# EasyEDA Pro project 纯贴片元件搭建NE555.epro

# Schematic 纯贴片元件搭建NE555 copy
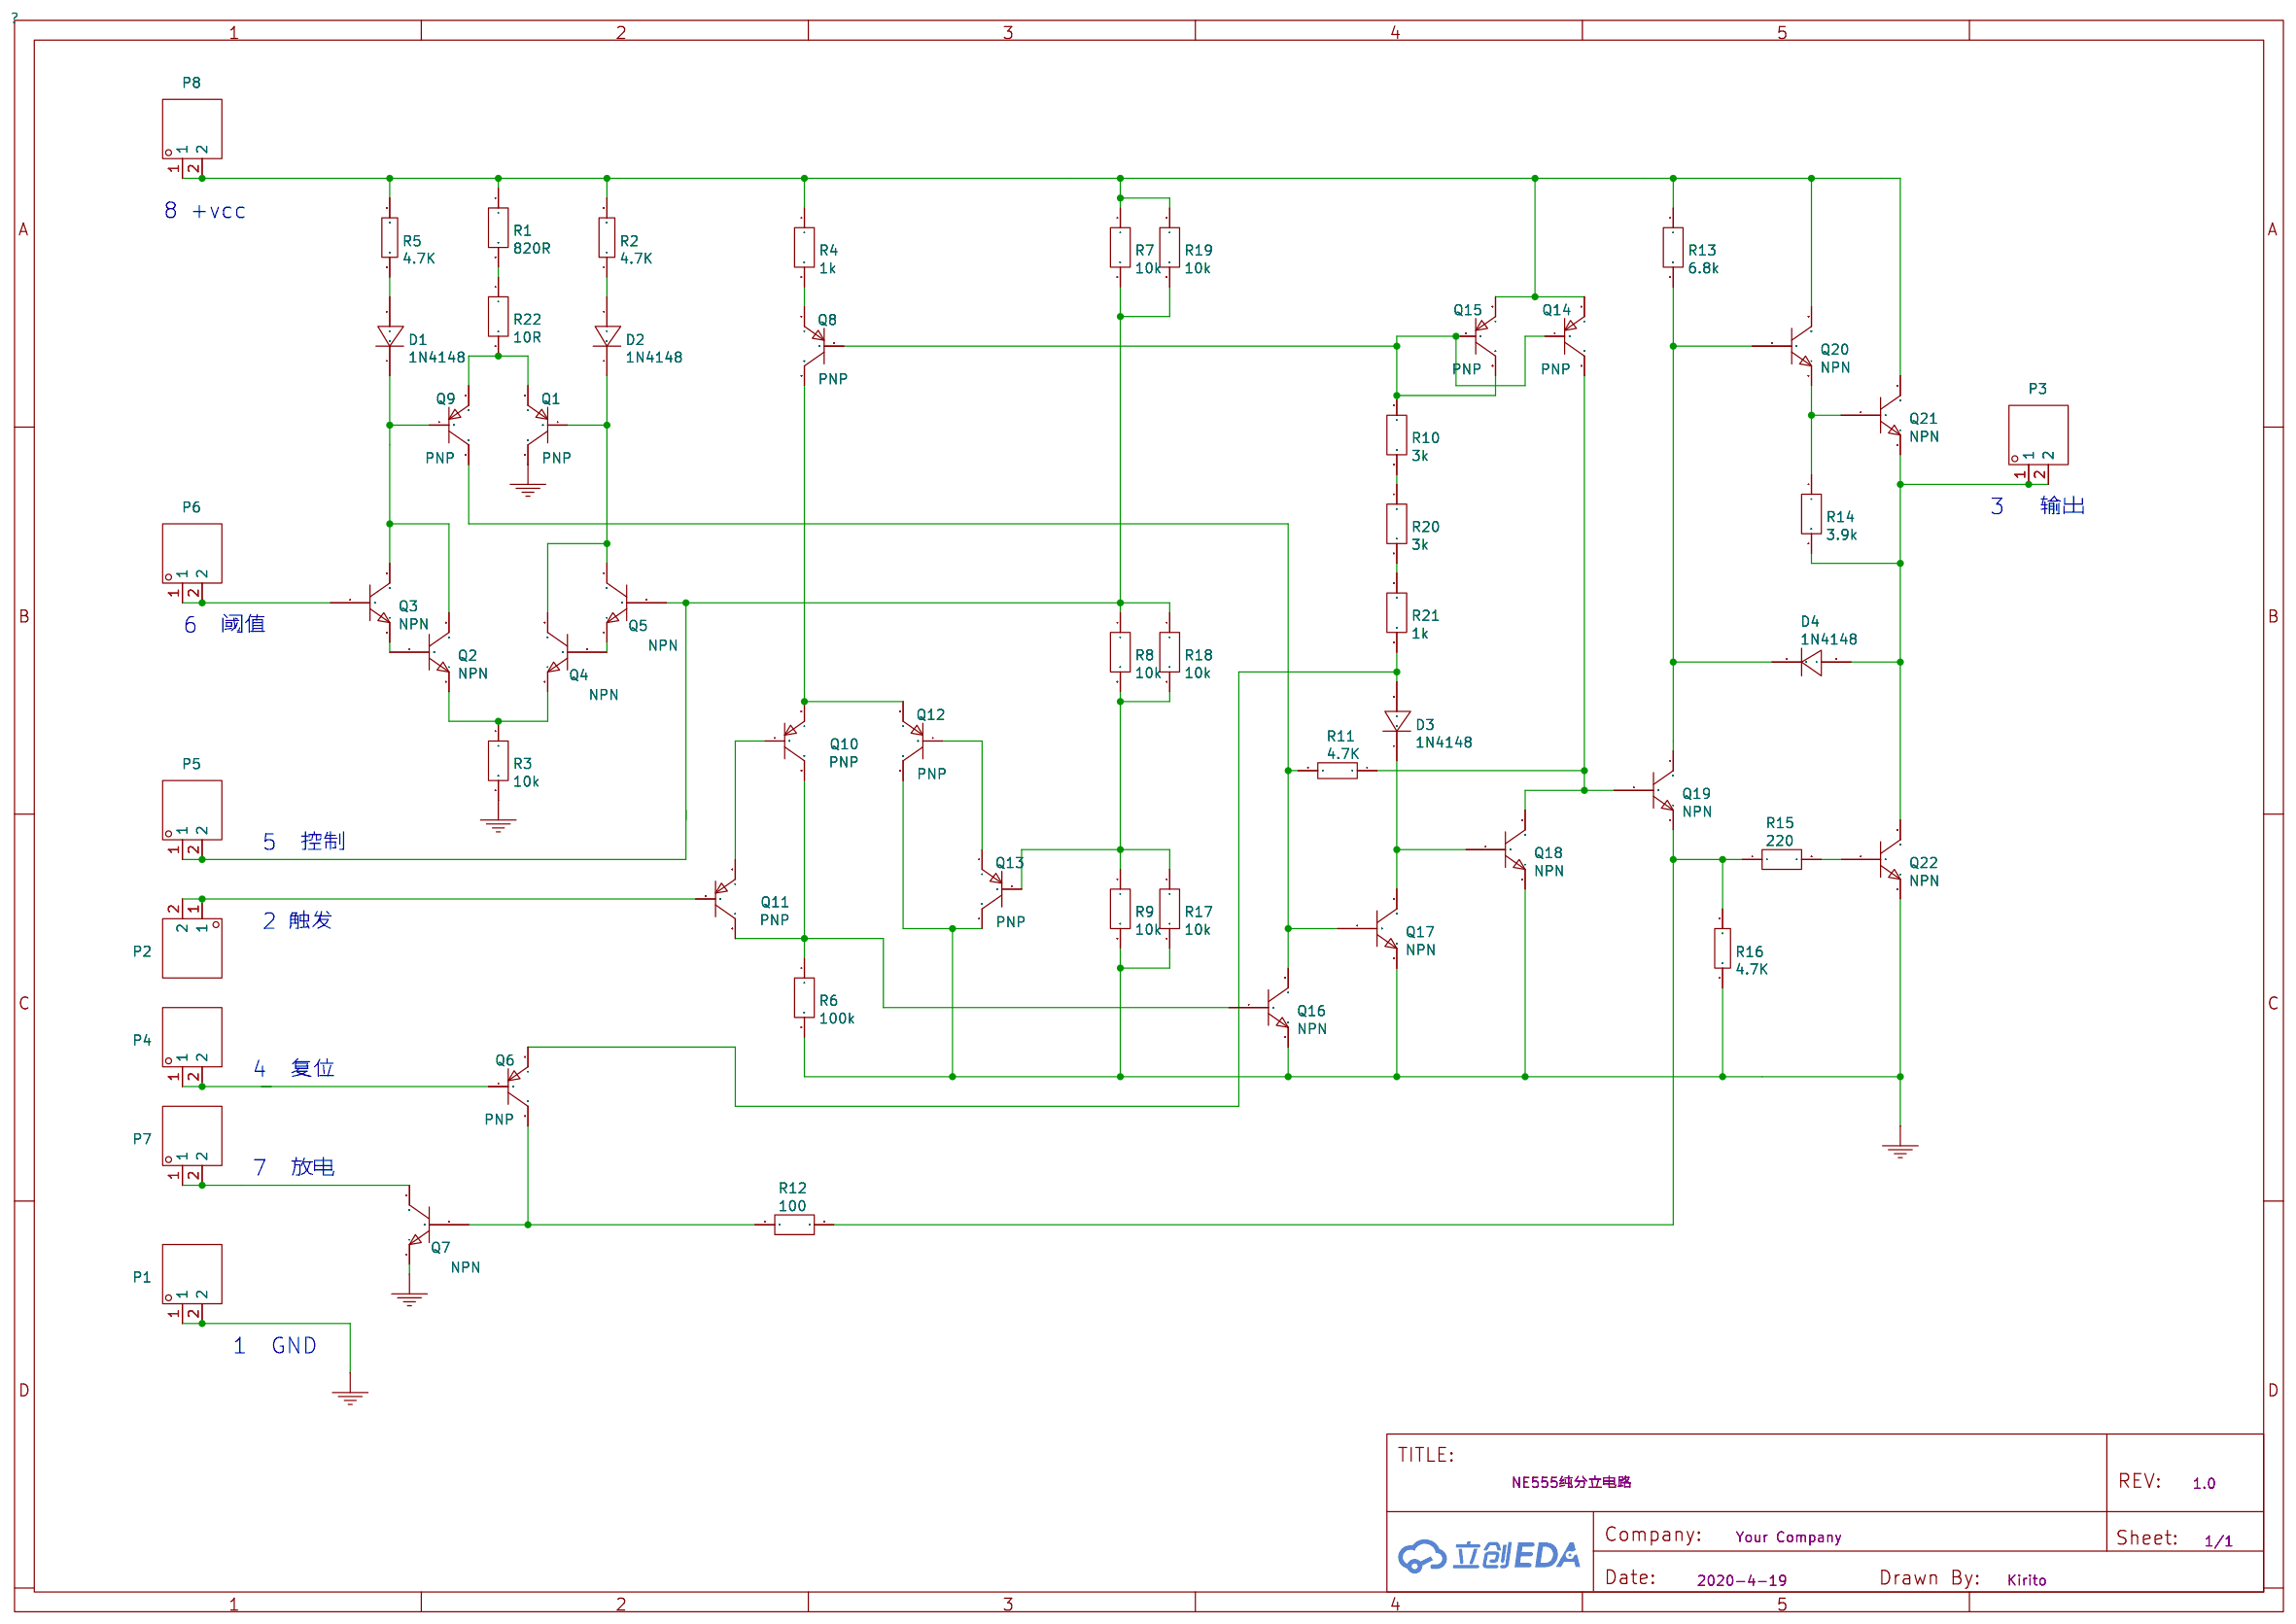
[diagram p0: schematic sheet]

## Parts
D1  1N4148  [SOD-523_L1.2-W0.8-LS1.6-RD]
D2  1N4148  [SOD-523_L1.2-W0.8-LS1.6-RD]
D3  1N4148  [SOD-523_L1.2-W0.8-LS1.6-RD]
D4  1N4148  [SOD-523_L1.2-W0.8-LS1.6-RD]
P1  RE-H022TD-1190 (LF)(SN)  [HDR-TH_2P-P2.54-V]
P2  RE-H022TD-1190 (LF)(SN)  [HDR-TH_2P-P2.54-V]
P3  RE-H022TD-1190 (LF)(SN)  [HDR-TH_2P-P2.54-V]
P4  RE-H022TD-1190 (LF)(SN)  [HDR-TH_2P-P2.54-V]
P5  RE-H022TD-1190 (LF)(SN)  [HDR-TH_2P-P2.54-V]
P6  RE-H022TD-1190 (LF)(SN)  [HDR-TH_2P-P2.54-V]
P7  RE-H022TD-1190 (LF)(SN)  [HDR-TH_2P-P2.54-V]
P8  RE-H022TD-1190 (LF)(SN)  [HDR-TH_2P-P2.54-V]
Q1  PNP  [SOT-23-3_L2.9-W1.6-P1.90-LS2.8-BR]
Q2  NPN  [SOT-23-3_L2.9-W1.3-P1.90-LS2.4-BR]
Q3  NPN  [SOT-23-3_L2.9-W1.3-P1.90-LS2.4-BR]
Q4  NPN  [SOT-23-3_L2.9-W1.3-P1.90-LS2.4-BR]
Q5  NPN  [SOT-23-3_L2.9-W1.3-P1.90-LS2.4-BR]
Q6  PNP  [SOT-23-3_L2.9-W1.6-P1.90-LS2.8-BR]
Q7  NPN  [SOT-23-3_L2.9-W1.3-P1.90-LS2.4-BR]
Q8  PNP  [SOT-23-3_L2.9-W1.6-P1.90-LS2.8-BR]
Q9  PNP  [SOT-23-3_L2.9-W1.6-P1.90-LS2.8-BR]
Q10  PNP  [SOT-23-3_L2.9-W1.6-P1.90-LS2.8-BR]
Q11  PNP  [SOT-23-3_L2.9-W1.6-P1.90-LS2.8-BR]
Q12  PNP  [SOT-23-3_L2.9-W1.6-P1.90-LS2.8-BR]
Q13  PNP  [SOT-23-3_L2.9-W1.6-P1.90-LS2.8-BR]
Q14  PNP  [SOT-23-3_L2.9-W1.6-P1.90-LS2.8-BR]
Q15  PNP  [SOT-23-3_L2.9-W1.6-P1.90-LS2.8-BR]
Q16  NPN  [SOT-23-3_L2.9-W1.3-P1.90-LS2.4-BR]
Q17  NPN  [SOT-23-3_L2.9-W1.3-P1.90-LS2.4-BR]
Q18  NPN  [SOT-23-3_L2.9-W1.3-P1.90-LS2.4-BR]
Q19  NPN  [SOT-23-3_L2.9-W1.3-P1.90-LS2.4-BR]
Q20  NPN  [SOT-23-3_L2.9-W1.3-P1.90-LS2.4-BR]
Q21  NPN  [SOT-23-3_L2.9-W1.3-P1.90-LS2.4-BR]
Q22  NPN  [SOT-23-3_L2.9-W1.3-P1.90-LS2.4-BR]
R1  820R  [R0603]
R2  4.7K  [R0603]
R3  10k  [R0603]
R4  1k  [R0603]
R5  4.7K  [R0603]
R6  100k  [R0603]
R7  10k  [R0603]
R8  10k  [R0603]
R9  10k  [R0603]
R10  3k  [R0603]
R11  4.7K  [R0603]
R12  100  [R0603]
R13  6.8k  [R0603]
R14  3.9k  [R0603]
R15  220  [R0603]
R16  4.7K  [R0603]
R17  10k  [R0603]
R18  10k  [R0603]
R19  10k  [R0603]
R20  3k  [R0603]
R21  1k  [R0603]
R22  10R  [R0603]

## Library data of the parts
D1-D4 = 1N4148
P1-P8 = RE-H022TD-1190 (LF)(SN)
Q1 Q6 Q8-Q15 = PNP
Q2-Q5 Q7 Q16-Q22 = NPN
R1 = 820R
R2 R5 R11 R16 = TC0325B4701T5E: Supplier: LCSC; Manufacturer: UniOhm; Supplier Part: C148464; JLCPCB Part Class: Extend
R3 R7-R9 R17-R19 = 10k
R4 R21 = 1k
R6 = 100k
R10 R20 = 3k
R12 = 100
R13 = 6.8k
R14 = 3.9k
R15 = 220
R22 = 10R

## Nets
GND: P1.1 P1.2 Q1.3(C) Q7.2(E) Q12.3(C) Q13.3(C) Q16.2(E) Q17.2(E) Q18.2(E) Q22.2(E) R3.2 R6.2 R9.2 R16.1 R17.2
D3_1: D3.1(C) Q17.3(C) Q18.1(B)
Net-(D1-2): D1.2(A) R5.1
Net-(D2-2): D2.2(A) R2.1
Net-(P8-1): P8.1 P8.2 Q14.2(E) Q15.2(E) Q20.3(C) Q21.3(C) R1.1 R2.2 R4.1 R5.2 R7.1 R13.1 R19.1
Net-(Q9-3): Q9.3(C) Q16.3(C) Q17.1(B) R11.2
Net-(Q14-3): Q14.3(C) Q18.3(C) Q19.1(B) R11.1
Net-(Q19-2): Q19.2(E) R12.2 R15.1 R16.2
P4_1: P4.1 P4.2 Q6.1(B)
P7_1: P7.1 P7.2 Q7.3(C)
Q1_2: Q1.2(E) Q9.2(E) R22.2
Q2_1: Q2.1(B) Q3.2(E)
Q2_3: D1.1(C) Q2.3(C) Q3.3(C) Q9.1(B)
Q3_1: P6.1 P6.2 Q3.1(B)
Q4_1: Q4.1(B) Q5.2(E)
Q4_3: D2.1(C) Q1.1(B) Q4.3(C) Q5.3(C)
Q6_2: D3.2(A) Q6.2(E) R21.2
Q10_1: Q10.1(B) Q11.2(E)
Q11_1: P2.1 P2.2 Q11.1(B)
Q12_1: Q12.1(B) Q13.2(E)
Q12_2: Q8.3(C) Q10.2(E) Q12.2(E)
R1_2: R1.2 R22.1
R3_1: Q2.2(E) Q4.2(E) R3.1
R4_2: Q8.2(E) R4.2
R6_1: Q10.3(C) Q11.3(C) Q16.1(B) R6.1
R7_2: P5.1 P5.2 Q5.1(B) R7.2 R8.1 R18.1 R19.2
R8_2: Q13.1(B) R8.2 R9.1 R17.1 R18.2
R10_1: Q8.1(B) Q14.1(B) Q15.1(B) Q15.3(C) R10.1
R10_2: R10.2 R20.1
R12_1: Q6.3(C) Q7.1(B) R12.1
R13_2: D4.1(C) Q19.3(C) Q20.1(B) R13.2
R14_1: Q20.2(E) Q21.1(B) R14.1
R14_2: D4.2(A) P3.1 P3.2 Q21.2(E) Q22.3(C) R14.2
R15_2: Q22.1(B) R15.2
R20_2: R20.2 R21.1

## Notes on the sheet
- 8 +vcc
- 3   输出
- 6  阈值
- 5  控制
- 2 触发
- 4  复位
- 7  放电
- 1  GND

# Board 1-PCB_PCB_2020-04-19_14-16-21 copy
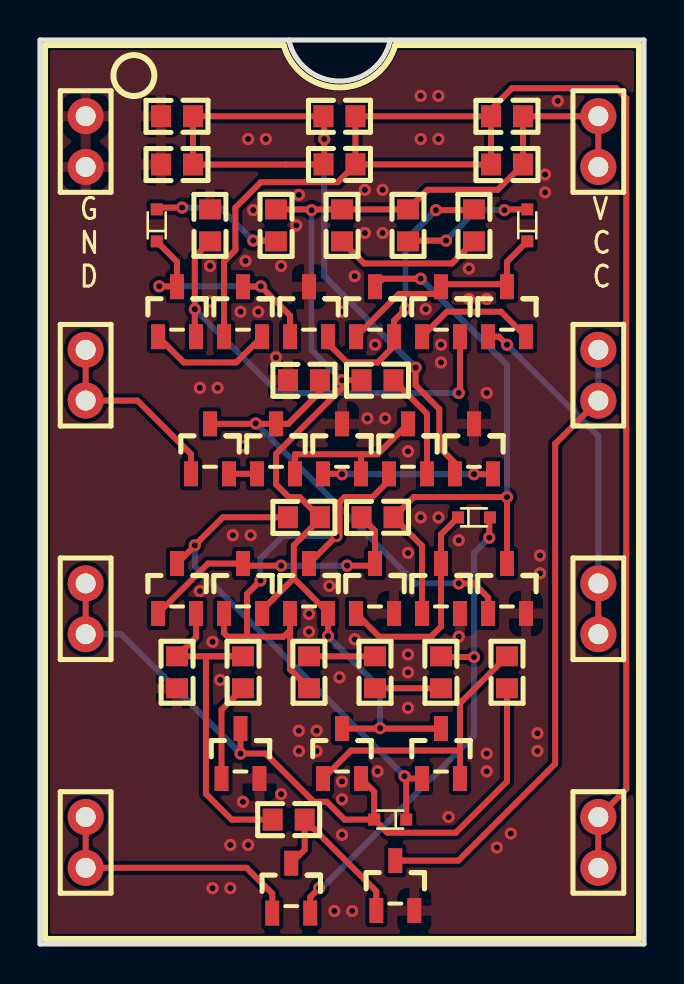
[diagram p1: board, top side]
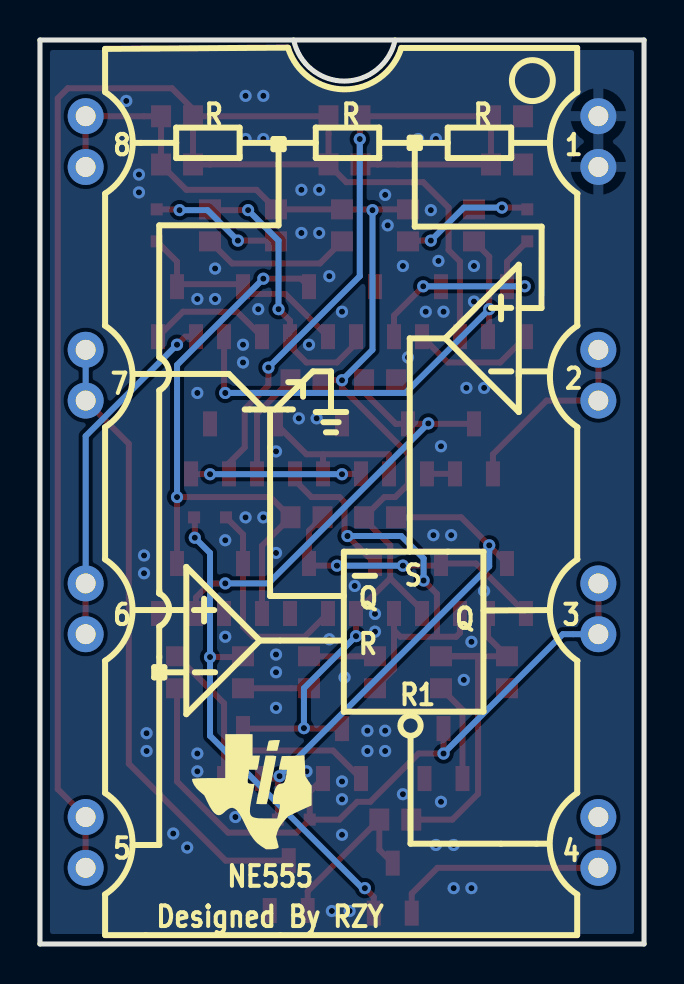
[diagram p2: board, bottom side, seen from below]

Outline 30.23 x 45.21 mm; copper layers: Top Layer, Bottom Layer. Coordinates in mm from the lower left corner of the outline.
Outline path: 17.53,45.21 arc(14.99,43.16) 12.46,45.21 ; 0,45.21 30.23,45.21 30.23,0 0,0 0,45.21
Stack: Top Layer 0.035mm - / Dielectric1 1.51mm FR4 er 4.5 / Bottom Layer 0.035mm -

## Design rules (mm)
spacing Default (default): track to track 0.152, other pairs 0 to 0.152
track width Default (default): min 0.254, default 0.254, max 25.4
differential pair differentialPair (default): width min 0.127, default 0.254, max 2.54; gap min 0.152, default 0.152
via Default (default): diameter min 0.61, default 0.61, max 100.025; hole min 0.305, default 0.305, max 59.995
net GND uses (1)
pour e1 uses CopperRegion
pour e2 uses (1)

## Placement (name value [footprint] x y rotation side)
D1  1N4148  [SOD-523_L1.2-W0.8-LS1.6-RD]  24.38 35.94 90 top
D2  1N4148  [SOD-523_L1.2-W0.8-LS1.6-RD]  5.84 35.94 90 top
D3  1N4148  [SOD-523_L1.2-W0.8-LS1.6-RD]  21.72 21.34 0 top
D4  1N4148  [SOD-523_L1.2-W0.8-LS1.6-RD]  17.53 6.22 180 top
P1  RE-H022TD-1190 (LF)(SN)  [HDR-TH_2P-P2.54-V]  2.29 40.13 90 top
P2  RE-H022TD-1190 (LF)(SN)  [HDR-TH_2P-P2.54-V]  2.29 28.45 90 top
P3  RE-H022TD-1190 (LF)(SN)  [HDR-TH_2P-P2.54-V]  2.29 16.76 90 top
P4  RE-H022TD-1190 (LF)(SN)  [HDR-TH_2P-P2.54-V]  2.29 5.08 90 top
P5  RE-H022TD-1190 (LF)(SN)  [HDR-TH_2P-P2.54-V]  27.94 5.08 270 top
P6  RE-H022TD-1190 (LF)(SN)  [HDR-TH_2P-P2.54-V]  27.94 16.76 270 top
P7  RE-H022TD-1190 (LF)(SN)  [HDR-TH_2P-P2.54-V]  27.94 28.45 270 top
P8  RE-H022TD-1190 (LF)(SN)  [HDR-TH_2P-P2.54-V]  27.94 40.13 270 top
Q1  PNP  [SOT-23-3_L2.9-W1.6-P1.90-LS2.8-BR]  13.46 31.62 270 top
Q2  NPN  [SOT-23-3_L2.9-W1.3-P1.90-LS2.4-BR]  20.07 31.62 270 top
Q3  NPN  [SOT-23-3_L2.9-W1.3-P1.90-LS2.4-BR]  23.37 31.62 270 top
Q4  NPN  [SOT-23-3_L2.9-W1.3-P1.90-LS2.4-BR]  6.86 31.62 270 top
Q5  NPN  [SOT-23-3_L2.9-W1.3-P1.90-LS2.4-BR]  10.16 31.62 270 top
Q6  PNP  [SOT-23-3_L2.9-W1.6-P1.90-LS2.8-BR]  12.57 2.79 270 top
Q7  NPN  [SOT-23-3_L2.9-W1.3-P1.90-LS2.4-BR]  17.78 2.92 270 top
Q8  PNP  [SOT-23-3_L2.9-W1.6-P1.90-LS2.8-BR]  18.41 24.77 270 top
Q9  PNP  [SOT-23-3_L2.9-W1.6-P1.90-LS2.8-BR]  16.76 31.62 270 top
Q10  PNP  [SOT-23-3_L2.9-W1.6-P1.90-LS2.8-BR]  11.81 24.77 270 top
Q11  PNP  [SOT-23-3_L2.9-W1.6-P1.90-LS2.8-BR]  8.51 24.77 270 top
Q12  PNP  [SOT-23-3_L2.9-W1.6-P1.90-LS2.8-BR]  15.11 24.77 270 top
Q13  PNP  [SOT-23-3_L2.9-W1.6-P1.90-LS2.8-BR]  21.72 24.77 270 top
Q14  PNP  [SOT-23-3_L2.9-W1.6-P1.90-LS2.8-BR]  10.16 17.78 270 top
Q15  PNP  [SOT-23-3_L2.9-W1.6-P1.90-LS2.8-BR]  13.46 17.78 270 top
Q16  NPN  [SOT-23-3_L2.9-W1.3-P1.90-LS2.4-BR]  23.37 17.78 270 top
Q17  NPN  [SOT-23-3_L2.9-W1.3-P1.90-LS2.4-BR]  20.07 17.78 270 top
Q18  NPN  [SOT-23-3_L2.9-W1.3-P1.90-LS2.4-BR]  16.76 17.78 270 top
Q19  NPN  [SOT-23-3_L2.9-W1.3-P1.90-LS2.4-BR]  6.86 17.78 270 top
Q20  NPN  [SOT-23-3_L2.9-W1.3-P1.90-LS2.4-BR]  20.07 9.53 270 top
Q21  NPN  [SOT-23-3_L2.9-W1.3-P1.90-LS2.4-BR]  15.11 9.53 270 top
Q22  NPN  [SOT-23-3_L2.9-W1.3-P1.90-LS2.4-BR]  10.03 9.53 270 top
R1  820R  [R0603]  15.11 35.94 270 top
R2  4.7K  [R0603]  11.81 35.94 270 top
R3  10k  [R0603]  8.51 35.94 90 top
R4  1k  [R0603]  16.89 28.19 0 top
R5  4.7K  [R0603]  18.41 35.94 270 top
R6  100k  [R0603]  13.21 28.19 180 top
R7  10k  [R0603]  23.37 38.98 180 top
R8  10k  [R0603]  14.99 38.99 180 top
R9  10k  [R0603]  6.86 41.4 180 top
R10  3k  [R0603]  13.46 13.59 90 top
R11  4.7K  [R0603]  16.89 21.34 180 top
R12  100  [R0603]  12.45 6.22 180 top
R13  6.8k  [R0603]  13.21 21.34 180 top
R14  3.9k  [R0603]  23.37 13.59 270 top
R15  220  [R0603]  10.16 13.59 270 top
R16  4.7K  [R0603]  6.86 13.59 270 top
R17  10k  [R0603]  6.86 38.98 180 top
R18  10k  [R0603]  14.99 41.4 180 top
R19  10k  [R0603]  23.37 41.4 180 top
R20  3k  [R0603]  16.76 13.59 270 top
R21  1k  [R0603]  20.07 13.59 90 top
R22  10R  [R0603]  21.72 35.94 90 top

## Footprints (pads in the part's own frame, mm; a bottom-side part is the same pattern mirrored in y, then rotated)
HDR-TH_2P-P2.54-V
  round 1.8 hole 1: 1(-1.27,0) 2(1.27,0)
R0603
  rect 1x1.1 smd: 1(-0.8,0) 2(0.8,0)
SOD-523_L1.2-W0.8-LS1.6-RD
  rect 0.6x0.6 smd: 1(-0.8,0) 2(0.8,0)
SOT-23-3_L2.9-W1.3-P1.90-LS2.4-BR
  rect 1.25x0.7 smd: 1(1.25,-0.95) 2(1.25,0.95) 3(-1.25,0)
SOT-23-3_L2.9-W1.6-P1.90-LS2.8-BR
  rect 1.25x0.7 smd: 1(1.25,-0.95) 2(1.25,0.95) 3(-1.25,0)

## Nets
As in the schematic, except:
GND: P1.1 P1.2 Q1.3 Q7.2 Q12.3 Q13.3 Q16.2 Q17.2 Q18.2 Q22.2 R3.2 R6.2 R9.2 R16.2 R17.2
R2_2: D2.2 R2.2
R5_1: P8.1 P8.2 Q14.2 Q15.2 Q20.3 Q21.3 R1.1 R2.1 R4.1 R5.1 R7.1 R13.1 R19.1
R5_2: D1.2 R5.2
R11_1: Q9.3 Q16.3 Q17.1 R11.1
R11_2: Q14.3 Q18.3 Q19.1 R11.2
R12_2: Q19.2 R12.2 R15.1 R16.1

## Via types
v1: diameter 0.61, hole 0.305, Top Layer to Bottom Layer, 96 vias
v2: diameter 0.61, hole 0.31, Top Layer to Bottom Layer, 19 vias

## Routing (per net, layer and track width the routed paths; a pad name or vN(x,y) marks a point on that pad's centre or on a via; arc(x,y) is an arc through that point)
GND:
  vias: v1(8,27.81) v1(8,17.65) v1(8.51,33.91) v1(8.51,32.13) v1(8.64,15.11) v1(8.64,2.79) v1(8.89,27.81) v1(9.02,13.21) v1(9.53,4.95) v1(9.53,2.79) v1(9.65,20.45) v1(10.03,31.62) v1(10.16,24.89) v1(10.16,7.11) v1(10.29,34.16) v1(10.41,40.26) v1(10.41,4.95) v1(10.54,20.45) v1(10.67,36.7) v1(10.92,31.62) v1(11.3,40.26) v1(11.81,29.34) v1(12.06,33.91) v1(12.06,7.49) v1(12.83,35.94) v1(12.95,37.47) v1(12.95,10.67) v1(12.95,9.65) v1(13.46,16.51) v1(13.46,15.62) v1(13.84,10.67) v1(13.84,9.65) v1(14.48,17.91) v1(14.73,1.65) v1(14.99,13.33) v1(15.11,31.62) v1(15.11,8.13) v1(15.11,7.24) v1(15.11,5.46) v1(15.62,1.65) v1(15.75,33.4) v1(15.75,15.24) v1(16.26,37.72) v1(16.26,35.56) v1(16.38,26.29) v1(16.76,29.97) v1(16.89,8.64) v1(17.15,37.72) v1(17.15,35.56) v1(17.27,26.29) v1(18.41,24.64) v1(18.41,19.56) v1(18.41,14.48) v1(18.41,13.59) v1(18.41,11.81) v1(19.05,42.42) v1(19.05,40.26) v1(19.05,21.34) v1(19.3,31.75) v1(19.94,42.42) v1(19.94,40.26) v1(19.94,21.34) v1(20.07,29.97) v1(20.07,29.08) v1(20.45,6.35) v1(20.95,20.19) v1(20.95,15.37) v1(21.46,33.78) v1(21.46,32.26) v1(22.35,32.26) v1(22.35,27.56) v1(22.35,9.53) v1(22.35,8.64) v1(22.86,4.83) v1(23.56,5.52) v1(24.89,10.54) v1(24.89,9.65) v1(25.02,19.43) v1(25.02,18.54) v1(25.27,38.48) v1(25.27,37.59) v1(25.91,42.16)
D3_1: length 10.8
  Top Layer w0.3: D3.1 20.07,20.49 Q17.3 20.07,15.88 19.56,15.37 16.98,15.37 15.81,16.53
P4_1: length 13.4
  Top Layer w0.3: P4.2 P4.1 10.34,3.81 11.62,2.52 Q6.1
P7_1: length 31.6
  Top Layer w0.3: P7.2 25.78,25.02 25.78,9.02 20.93,4.17 Q7.3
  Bottom Layer w0.3: P7.1 P7.2
Q1_2: length 14.9
  Top Layer w0.3: R22.2 21.68,36.7 v1(19.81,36.7) ; 14.41,29.89 Q1.2 14.41,30.04 15.37,29.08 16.89,29.08 17.71,29.91 Q9.2 ; v1(18.29,31.75) 17.71,31.18 Q9.2 ; Q9.2 17.71,29.89
  Bottom Layer w0.3: v1(19.81,36.7) 18.29,35.18 v1(18.29,31.75)
Q2_1: length 6.2
  Top Layer w0.3: Q3.2 23.07,31.62 20.37,31.62 Q2.1
Q2_3: length 11.6
  Top Layer w0.3: D1.1 23.37,34.12 Q3.3 23.37,33 20.07,33 ; Q9.1 17.95,32.51 20.07,32.51 Q2.3
Q3_1: length 17.5
  Top Layer w0.3: v2(23.37,29.97) 22.97,30.37 Q3.1 ; P6.1 P6.2
  Bottom Layer w0.3: P6.1 27.94,25.4 v2(23.37,29.97)
Q4_1: length 6.3
  Top Layer w0.3: Q5.2 9.82,29.08 7.2,29.08 Q4.1
Q4_3: length 13.2
  Top Layer w0.3: Q1.1 12.51,31.43 v1(11.05,32.89) Q5.3 ; D2.1 6.86,34.12 Q4.3 ; v1(5.97,32.89) 6.84,32.89 Q4.3 ; Q4.3 6.86,33.42
  Bottom Layer w0.3: v1(5.97,32.89) v1(11.05,32.89)
Q6_2: length 25.3
  Top Layer w0.3: D3.2 22.48,21.3 v1(22.48,20.32) ; v1(21.72,14.35) 20.1,14.35 R21.2 ; Q6.2 13.52,2.35 v2(13.97,2.79)
  Bottom Layer w0.3: v2(13.97,2.79) 14.1,2.79 21.72,10.41 v1(21.72,14.35) 21.72,19.56 v1(22.48,20.32)
Q10_1: length 1.4
  Top Layer w0.3: 10.86,23.52 9.46,23.52
Q11_1: length 9.9
  Top Layer w0.3: P2.2 P2.1 4.87,27.18 7.56,24.49 Q11.1
Q12_1: length 8.5
  Top Layer w0.3: v2(15.11,23.5) 15.09,23.52 Q12.1 ; 22.67,23.52 22.65,23.5 v2(21.72,23.5)
  Bottom Layer w0.3: v2(21.72,23.5) v2(15.11,23.5)
Q12_2: length 8.2
  Top Layer w0.3: Q12.2 16.06,24.49 ; 16.06,24.49 12.76,24.49 Q10.2 ; 16.06,24.49 16.89,24.49 Q8.3
R1_2: length 7.5
  Top Layer w0.3: R1.2 16.22,34.04 20.61,34.04 R22.1
R2_2: length 6.7
  Top Layer w0.3: D2.2 5.93,36.83 v1(7.11,36.83) ; R2.2 11.77,35.18 v1(10.67,35.18)
  Bottom Layer w0.3: v1(10.67,35.18) 9.02,36.83 v1(7.11,36.83)
R3_1: length 22.9
  Top Layer w0.3: R3.1 7.75,34.38 v2(7.75,31.75) 7.75,30.43 Q4.2 ; Q2.2 21.02,27.62 v2(20.95,27.56)
  Bottom Layer w0.3: v2(7.75,31.75) 11.94,27.56 v2(20.95,27.56)
R4_2: length 5.4
  Top Layer w0.3: Q8.2 19.37,26.52 R4.2
R5_1: length 62.8
  Top Layer w0.3: R7.1 22.9,37.72 19.39,37.72 R5.1 R1.1 R2.1 ; R7.1 R19.1 ; R7.1 24.17,39.44 ; 11.11,16.53 11.11,16.7 12.7,18.29 ; 14.01,21.34 13,22.35 12.45,22.35 11.81,22.99 11.81,24.51 15.11,27.81 v1(15.11,28.19) 16.09,28.19 ; 12.7,18.29 12.7,19.94 14.01,21.25 R13.1 ; 12.7,18.29 14.41,16.58 14.41,16.53 ; 15.11,10.29 Q21.3 Q20.3 ; v2(14.41,15.4) Q15.2 ; 24.17,41.4 27.94,41.4 ; 27.94,41.4 P8.2 ; 27.94,41.4 P8.1
  Bottom Layer w0.3: v1(15.11,28.19) 13.59,29.72 v1(13.59,36.7) ; v2(17.02,10.8) 17.02,12.79 v2(14.41,15.4)
R5_2: length 6.6
  Top Layer w0.3: D1.2 23.28,36.74 v1(23.24,36.7) ; v2(20.32,35.18) 18.45,35.18 R5.2
  Bottom Layer w0.3: v2(20.32,35.18) 21.84,36.7 v1(23.24,36.7)
R6_1: length 23.6
  Top Layer w0.3: 14.01,27.87 R6.1 14.01,27.6 12.43,26.01 Q10.3 ; Q16.1 22.42,17.33 21.72,18.03 v2(20.95,18.03) ; Q10.3 11.81,25.53 ; Q10.3 Q11.3
  Bottom Layer w0.3: v2(10.79,26.03) 18.8,18.03 v2(20.95,18.03)
R7_2: length 78.8
  Top Layer w0.3: 15.79,38.99 15.79,41.4 ; 15.79,38.99 21.71,38.99 21.71,38.98 R7.2 22.57,41.75 23.62,42.8 28.83,42.8 29.34,42.29 29.34,7.75 P5.1 P5.2 ; 15.79,38.99 14.9,38.1 11.05,38.1 9.78,36.83 9.78,34.71 9.21,34.14 Q5.1 ; R18.1 R19.2
R8_2: length 37.4
  Top Layer w0.3: Q13.1 20.77,24.05 19.98,24.84 19.98,26.76 18.8,27.94 v2(18.8,28.83) ; R9.1 14.19,41.4 ; 7.66,41.4 R17.1 13.33,38.98 13.34,38.99 14.19,38.99 14.22,39.03 v1(14.22,40.26) 14.22,41.36 14.19,41.4
  Bottom Layer w0.3: v1(14.22,40.26) 14.22,33.4 v2(18.8,28.83)
R10_1: length 24.7
  Top Layer w0.3: Q14.1 9.21,15.55 9.4,15.37 12.19,15.37 12.51,15.69 12.51,16.53 ; Q15.1 12.51,13.74 R10.1 ; Q8.1 17.47,23.18 16.64,22.35 15.24,22.35 14.99,22.1 14.99,20.55 v2(14.84,20.4) Q15.3 ; 10.36,15.55 10.36,17.51 v2(11.03,18.18)
  Bottom Layer w0.3: v2(11.03,18.18) 11.03,19.29 12.15,20.4 v2(14.84,20.4)
R10_2: length 3.3
  Top Layer w0.3: R10.2 16.76,14.39
R11_1: length 30
  Top Layer w0.3: Q16.3 v1(23.37,22.35) 18.7,22.35 R11.1 19.12,19.92 19.12,16.53 ; Q9.3 17.17,33.27 v1(19.05,33.27)
  Bottom Layer w0.3: v1(19.05,33.27) 23.37,28.96 v1(23.37,22.35)
R11_2: length 14.8
  Top Layer w0.3: 10.16,18.92 v2(12.06,18.92) ; R11.2 16.76,20.67 Q18.3 16.76,18.92 v2(15.37,18.92) ; 10.16,18.84 Q14.3 8.41,19.03 Q19.1
  Bottom Layer w0.3: v2(12.06,18.92) v2(15.37,18.92)
R12_1: length 8.5
  Top Layer w0.3: Q7.1 16.83,2.64 R12.1 13.25,4.72 Q6.3
R12_2: length 18.5
  Top Layer w0.3: 10.16,14.39 8.97,14.39 8.3,14.39 8.3,7.51 9.59,6.22 R12.2 ; 7.81,16.53 7.81,15.34 R16.1 R15.1
R13_2: length 25.4
  Top Layer w0.3: 18.33,8.31 D4.1 ; 18.33,8.31 v2(18.24,8.39) ; 18.33,8.31 18.36,8.28 Q20.1 ; Q19.3 7.75,19.92 v2(7.75,19.94) 9.15,21.34 12.41,21.34
  Bottom Layer w0.3: v2(7.75,19.94) 7.75,18.89 v2(18.24,8.39)
R14_1: length 14.5
  Top Layer w0.3: Q21.1 15.56,9.68 21.02,9.68 ; Q20.2 21.02,12.04 23.37,14.39
R14_2: length 37
  Top Layer w0.3: Q21.2 16.73,7.61 D4.2 ; D4.2 15.24,6.22 14.35,7.11 13.7,7.11 11.28,9.53 v2(10.03,9.53) Q22.3 ; D4.2 17.38,5.57 20.81,5.57 23.37,8.13 23.37,12.79 ; P3.2 P3.1
  Bottom Layer w0.3: v2(10.03,9.53) 4.06,15.49 P3.1
R15_2: length 5
  Top Layer w0.3: Q22.1 9.08,11.71 R15.2
R20_2: length 3.3
  Top Layer w0.3: 16.76,12.79 R21.1

## Copper pours and planes (outline as drawn; the poured copper is in the pictures)
GND on Top Layer: -1.91,46.36 31.24,46.36 32.26,45.34 32.26,-1.52 32,-1.78 -2.03,-1.78
GND on Bottom Layer: -1.14,47.24 -0.89,46.99 31.37,46.99 31.5,46.86 31.5,-2.67 31.37,-2.79 -0.89,-2.79

## Text on the board
Bottom Silkscreen Layer: 1 | 2 | 3 | 4 | R | Q | S | 8 | 6 | 5 | 7 | Designed By RZY | R1 | NE555
Top Silkscreen Layer: G / N / D | V / C / C
